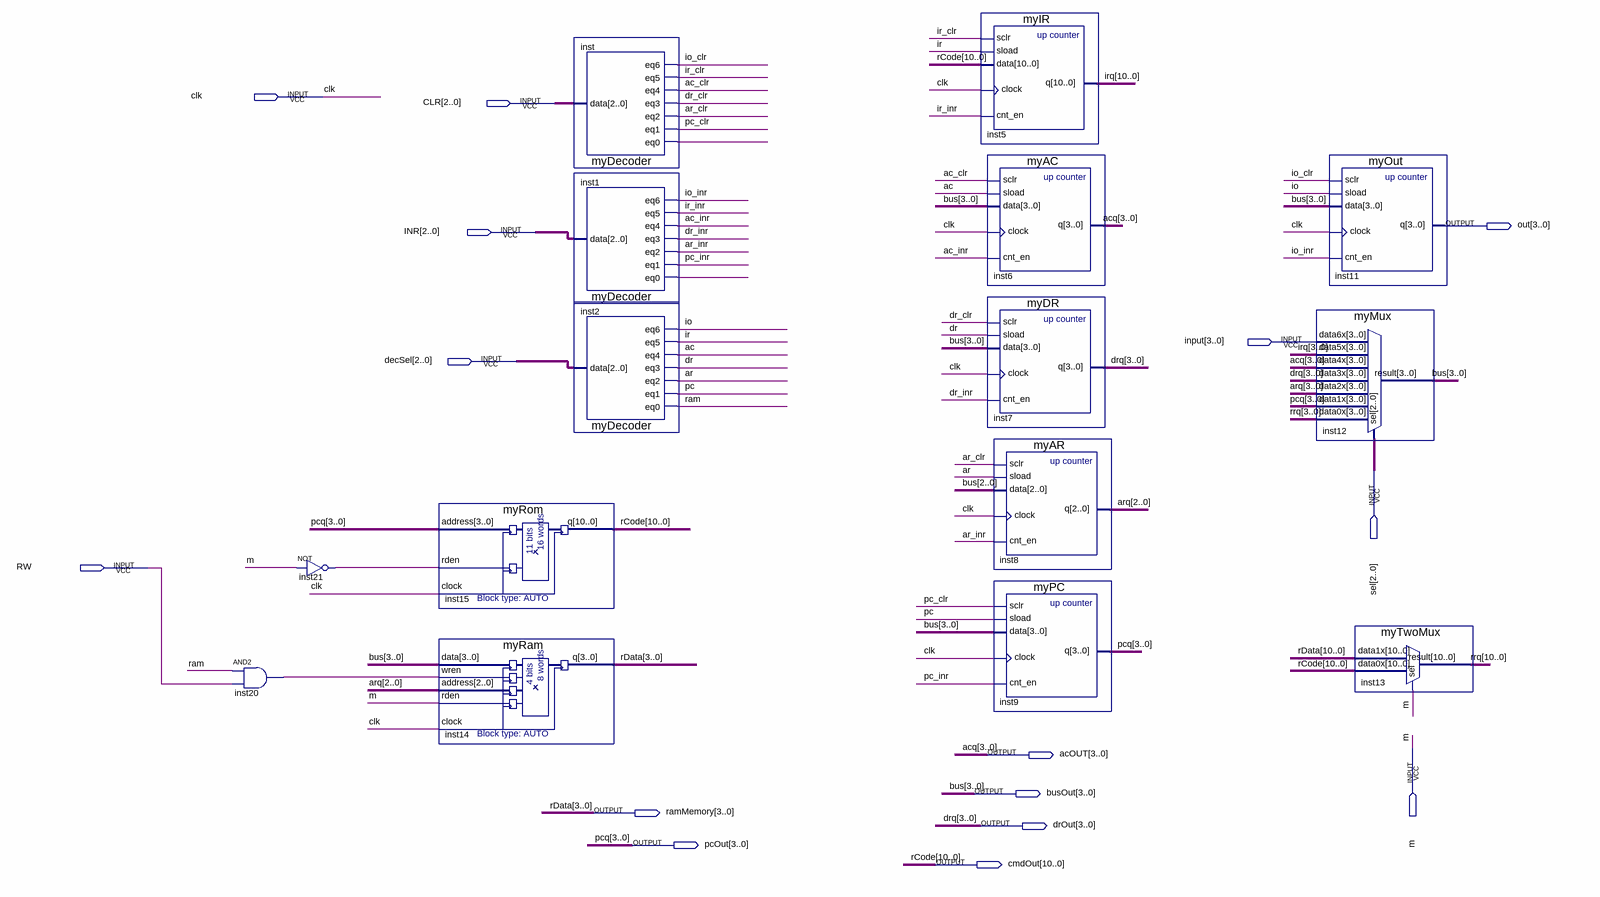
[diagram p0: schematic sheet]
// Quartus schematic 2015510098.bdf as structural Verilog: 15 symbols, 15 pins
module \2015510098  (
  input  clk,
  input  [2:0] CLR,
  input  [2:0] INR,
  input  [3:0] \input ,
  input  [2:0] decSel,
  input  [2:0] sel,
  input  RW,
  input  m,
  output [3:0] out,
  output [3:0] acOUT,
  output [3:0] busOut,
  output [3:0] ramMemory,
  output [3:0] drOut,
  output [3:0] pcOut,
  output [10:0] cmdOut
);

  wire ac, ac_clr, ac_inr, ar, ar_clr, ar_inr, dr, dr_clr, dr_inr, inst1_eq0, inst20_out, inst21_out,
       inst_eq0, io, io_clr, io_inr, ir, ir_clr, ir_inr, pc, pc_clr, pc_inr, ram;
  wire [3:0] arq;
  wire [10:0] irq, rrq;
  wire [10:4] rData;

  and inst20 (inst20_out, ram, RW);
  not inst21 (inst21_out, m);
  myRom inst15 (.address(pcOut), .rden(inst21_out), .clock(clk), .q(cmdOut));
  myRam inst14 (.data(busOut), .wren(inst20_out), .address(arq[2:0]), .rden(m), .clock(clk), .q(ramMemory));
  myDecoder inst (
    .data(CLR), .eq0(inst_eq0), .eq1(pc_clr), .eq2(ar_clr), .eq3(dr_clr), .eq4(ac_clr), .eq5(ir_clr),
    .eq6(io_clr));
  myDecoder inst1 (
    .data(INR), .eq0(inst1_eq0), .eq1(pc_inr), .eq2(ar_inr), .eq3(dr_inr), .eq4(ac_inr), .eq5(ir_inr),
    .eq6(io_inr));
  myDecoder inst2 (.data(decSel), .eq0(ram), .eq1(pc), .eq2(ar), .eq3(dr), .eq4(ac), .eq5(ir), .eq6(io));
  myIR inst5 (.sclr(ir_clr), .sload(ir), .data(cmdOut), .clock(clk), .cnt_en(ir_inr), .q(irq));
  myAC inst6 (.sclr(ac_clr), .sload(ac), .data(busOut), .clock(clk), .cnt_en(ac_inr), .q(acOUT));
  myDR inst7 (.sclr(dr_clr), .sload(dr), .data(busOut), .clock(clk), .cnt_en(dr_inr), .q(drOut));
  myAR inst8 (.sclr(ar_clr), .sload(ar), .data(busOut[2:0]), .clock(clk), .cnt_en(ar_inr), .q(arq[2:0]));
  myPC inst9 (.sclr(pc_clr), .sload(pc), .data(busOut), .clock(clk), .cnt_en(pc_inr), .q(pcOut));
  myOut inst11 (.sclr(io_clr), .sload(io), .data(busOut), .clock(clk), .cnt_en(io_inr), .q(out));
  myMux inst12 (
    .data6x(\input ), .data5x(irq[3:0]), .data4x(acOUT), .data3x(drOut), .data2x(arq), .data1x(pcOut),
    .data0x(rrq[3:0]), .sel(sel), .result(busOut));
  myTwoMux inst13 (.data1x({rData, ramMemory}), .data0x(cmdOut), .sel(m), .result(rrq));

  // Other names for the same wires on the sheet: acq[3:0] = acOUT; bus[3:0] = busOut; drq[3:0] = drOut;
  //   pcq[3:0] = pcOut; rCode[10:0] = cmdOut; rData[3:0] = ramMemory
endmodule
